# Altium schematic sheet Accumulator_Indicator.SchDoc
size A4; SheetNumber: 2; SheetTotal: 6
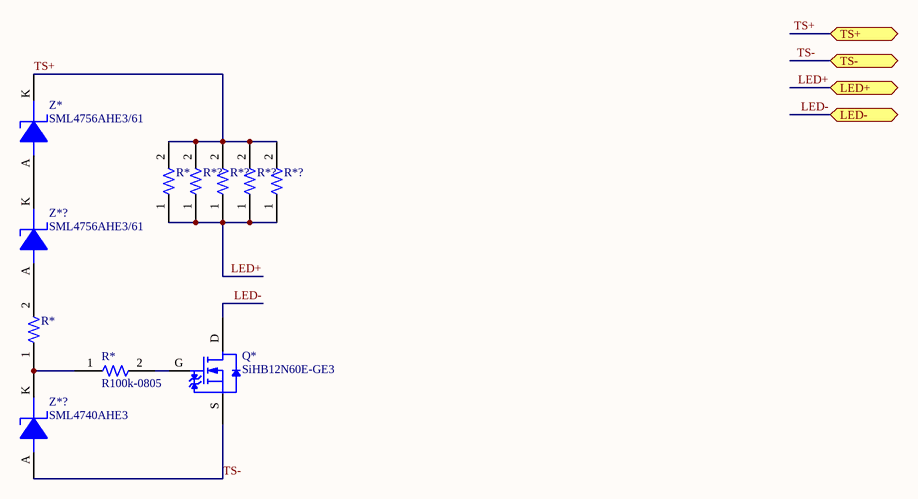
[diagram p0: Accumulator_Indicator.SchDoc]

## Parts
(Parts that share a designator on the sheet are numbered #1, #2 ... from top to bottom, then left to right.)
Q*  SiHB12N60E-GE3  [SiHB12N60E-GE3-Footprint-1]
R*#1  PR03000202203JDC00  [PR03000202203JDC00-Footprint-1]  (value not drawn)
R*#2  PR03000201003JAC00  [PR03000202203JDC00-Footprint-1]  (value not drawn)
R*#3  R100k-0805  [RESC2013X70X40NL20T20]
R*?#1  PR03000202203JDC00  [PR03000202203JDC00-Footprint-1]  (value not drawn)
R*?#2  PR03000202203JDC00  [PR03000202203JDC00-Footprint-1]  (value not drawn)
R*?#3  PR03000202203JDC00  [PR03000202203JDC00-Footprint-1]  (value not drawn)
R*?#4  PR03000202203JDC00  [PR03000202203JDC00-Footprint-1]  (value not drawn)
Z*  SML4756AHE3/61  [DIOM4227X23N]
Z*?#1  SML4756AHE3/61  [DIOM4227X23N]
Z*?#2  SML4740AHE3  [DIOM4227X23N]

## Ports
LED+ (bidir), LED- (bidir), TS+ (bidir), TS- (bidir)

## Nets
LED+: R*#1.1 R*?#1.1 R*?#2.1 R*?#3.1 R*?#4.1 ; port LED+
LED-: Q*.D ; port LED-
TS+: R*#1.2 R*?#1.2 R*?#2.2 R*?#3.2 R*?#4.2 Z*.K ; port TS+
TS-: Q*.S Z*?#2.A ; port TS-
NetQ*_G: Q*.G R*#3.2
NetR*#2_1: R*#2.1 R*#3.1 Z*?#2.K
NetR*#2_2: R*#2.2 Z*?#1.A
NetZ*_A: Z*.A Z*?#1.K

## Library data of the parts
Q* = CMP-013-00000-1: Power Field-Effect Transistor, 12A I(D), 600V, 0.38ohm, 1-Element, N-Channel, Silicon, Metal-oxide Semiconductor FET, TO-263AB; Max Operating Temperature: 150°C; RoHS Compliant: Yes; Pins: 2
R*#1 R*?#1-R*?#4 = CMP-009-00006-1: Fixed Resistor, Metal Film, 3W, 220000ohm, 750V, 5% +/-Tol, 250ppm/Cel, Through Hole Mount; RoHS Compliant: Yes
R*#2 = CMP-009-00007-2: Fixed Resistor, Metal Film, 3W, 100000ohm, 750V, 5% +/-Tol, 250ppm/Cel, Through Hole Mount; Value: 100k; Pins: 2; Tolerance: 5%; Min Operating Temperature: -55°C; Power: 3W; Max Operating Temperature: 155°C; Mounting Technology: Through Hole; RoHS Compliant: Yes
R*#3 = CMP-009-00003-2: Fixed Resistor, Metal Glaze/thick Film, 0.125W, 100000ohm, 150V, 5% +/-Tol, 200ppm/Cel, Surface Mount, 0805; Value: 100k; Power: 125mW; Max Operating Temperature: 155°C; Mounting Technology: Surface Mount; RoHS Compliant: Yes; Min Operating Temperature: -55°C; Pins: 2; Case/Package: 0805; Tolerance: 5%
Z* Z*?#1 = CMP-004-00000-1: Zener Diode, 47V V(Z), 5%, 1W, Silicon, Unidirectional, DO-214AC; Pins: 2; Max Operating Temperature: 150°C; RoHS Compliant: Yes
Z*?#2 = CMP-00196-1: Zener Diode, 10V V(Z), 5%, 1W, Silicon, Unidirectional, DO-214AC; Reference Standard: AEC-Q101; Time @ Peak Reflow Temperature-Max (s): 10s; Package Body Material: Plastic; Number of Elements: 1; Test Current: 25mA; Dynamic Impedance-Max: 7R; JESD-30 Code: R-PDSO-C2; Terminal Finish: Tin; Moisture Sensitivity Level: 1; RoHS Compliant: Yes; Technology: ZENER; Surface Mount: Yes; Max Power Dissipation: 1W; Pins: 2; JESD-609 Code: e3; Voltage Tol-Max: 5%; Diode Type: ZENER; Package Shape: Rectangular; Peak Reflow Temperature (Cel): 260°C; Terminal Form: C BEND; Reach SVHC Compliant: Yes; Reference Voltage-Nom: 10V; Max Operating Temperature: 150°C; JEDEC-95 Code: DO-214AC; Terminal Position: DUAL; Package Style: SMALL OUTLINEMeter; Diode Element Material: SILICON; Polarity: Unidirectional